# EAGLE design action_module_base (EAGLE 7.2.0)
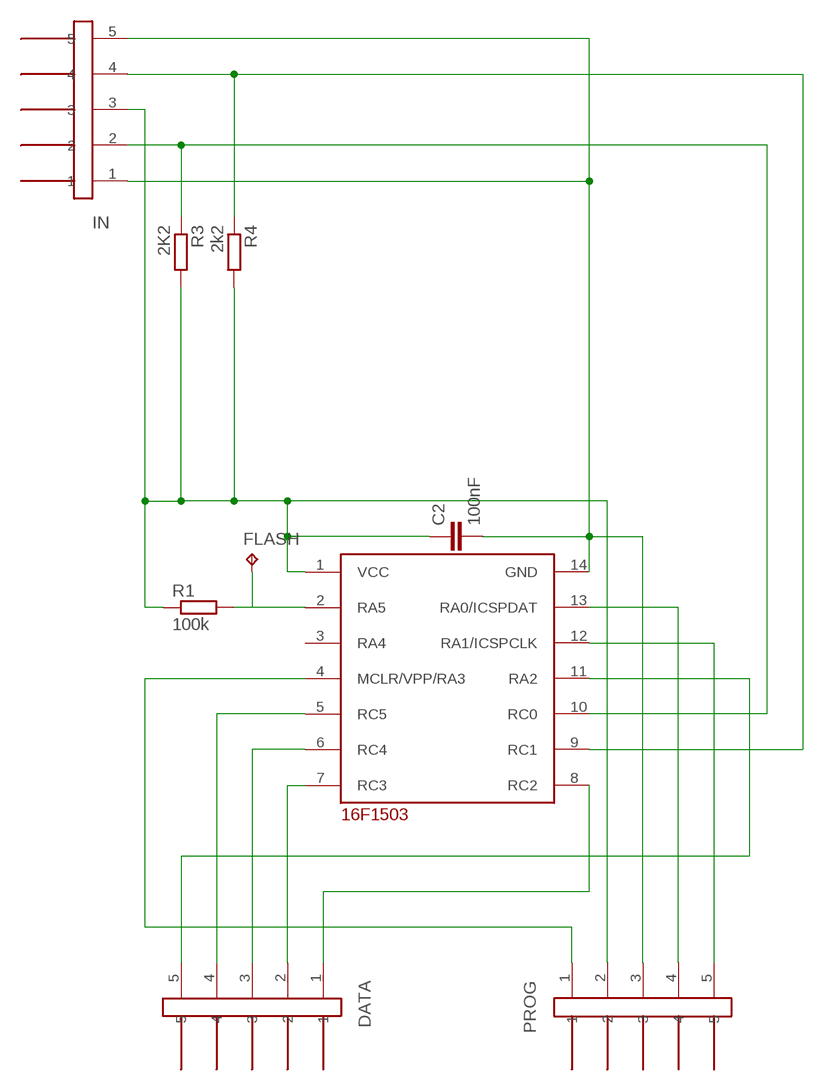
[diagram p0: schematic, sheet 1]

## Parts
C2  100nF  C-EUC0603K  [C0603K]
DATA  JUMPER5M  [JUMPER5M]
FLASH  TPB1,27  [B1,27]
IN  JUMPER5M-90  [JUMPER5M-90]
PROG  JUMPER5M  [JUMPER5M]
R1  100k  R-EU_R0603  [R0603]
R3  2K2  R-EU_R0603  [R0603]
R4  2k2  R-EU_R0603  [R0603]
U1  16F103-TSSOP  [TSSOP14]

## Nets
GND: C2.2 IN.1 IN.5 PROG.3 U1.14(GND)
N$1: DATA.2 U1.7(RC3)
N$2: IN.2 R3.1 U1.10(RC0)
N$3: FLASH.TP R1.2 U1.2(RA5)
N$5: IN.4 R4.1 U1.9(RC1)
N$11: DATA.5 U1.11(RA2)
N$12: DATA.4 U1.5(RC5)
N$13: PROG.1 U1.4(MCLR/VPP/RA3)
N$14: PROG.4 U1.13(RA0/ICSPDAT)
N$15: PROG.5 U1.12(RA1/ICSPCLK)
N$17: DATA.3 U1.6(RC4)
N$18: DATA.1 U1.8(RC2)
VCC: C2.1 IN.3 PROG.2 R1.1 R3.2 R4.2 U1.1(VCC)
Unconnected: U1.3(RA4)

## Library data of the parts
C2 = resistor:C-EU: CAPACITOR, European symbol
DATA PROG = !stavebnice03:JUMPER5M
FLASH = testpad:TP: Test pad
IN = !stavebnice03:JUMPER5M-90
R1 R3 R4 = resistor:R-EU_: RESISTOR, European symbol
U1 = !stavebnice03:16F103-TSSOP

## Net classes
0 default: clearance 0.205 mm

## Board
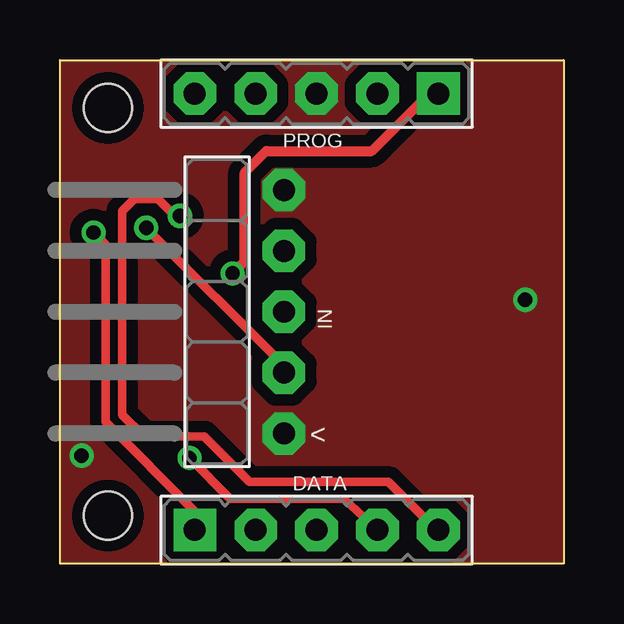
[diagram p1: board, top side]
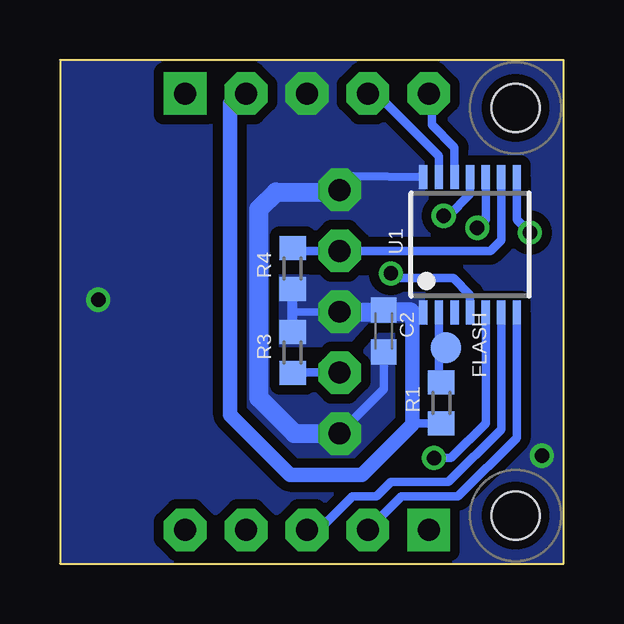
[diagram p2: board, bottom side, seen from below]

Size 21 x 21 mm. Coordinates in mm from the lower left corner, seen from the top.
Outline: 0,0 0,21 21,21 21,0 0,0
Copper layers (1*16): Top 0.035mm / dielectric 1.5mm / Bottom 0.035mm
Design rules "default *": minimum track width 10mil, minimum drill 0.6mm, track to track 8mil, track to pad 8mil, pad to pad 8mil, via to via 8mil, smd to smd 8mil, copper to edge 0mil, drill to drill 1mil, minimum pad ring 10mil, minimum via ring 8mil, stop-mask expansion 4mil, vias tented up to drill 0.7mm, thermal gap 10mil
Holes 2 mm at 2,19 2,2

### Footprints (pad centres in the part's own frame; a part is rotated, then mirrored left to right if it is on the bottom)
C0603K = smd 1.05 x 1.08: 1 -0.875,0; 2 0.875,0
JUMPER5M = drill 0.914 pad 1.778 square: 1 -5.08,0 | drill 0.914 pad 1.778 octagon: 2 -2.54,0; 3 0,0; 4 2.54,0; 5 5.08,0
B1,27 = smd 1.27 x 1.27: TP 0,0
JUMPER5M-90 = drill 0.914 pad 1.778 octagon: 1 -5.08,-2.54; 2 -2.54,-2.54; 3 0,-2.54; 4 2.54,-2.54; 5 5.08,-2.54
R0603 = smd 1 x 1.1: 1 -0.85,0; 2 0.85,0
TSSOP14 = smd 0.35 x 1: 1 -1.95,-2.825; 2 -1.3,-2.825; 3 -0.65,-2.825; 4 0,-2.825; 5 0.65,-2.825; 6 1.3,-2.825; 7 1.95,-2.825; 8 1.95,2.825; 9 1.3,2.825; 10 0.65,2.825; 11 0,2.825; 12 -0.65,2.825; 13 -1.3,2.825; 14 -1.95,2.825

### Placement (x,y rotation side)
C2  7.5,9.7 270 bottom
DATA  10.7,1.4 0 top
FLASH  4.9,9 0 bottom
IN  6.8,10.5 90 top
PROG  10.7,19.6 180 top
R1  5.1,6.7 90 bottom
R3  11.3,8.8 90 bottom
R4  11.3,12.3 270 bottom
U1  3.9,13.3 0 bottom

### Tracks (layer width: path | path; a pad name or v marks a point on that pad's centre or on a via)
GND  (via drill 0.6)
  Bottom 0.356: C2.2 7.5,7.28 IN.1 | 9.5,15.5 9.4,15.6 | U1.14 8.78,16.16 IN.5
  Bottom 0.8: 9.5,15.5 12,15.5 12.7,14.8 12.7,6.9 11.22,5.42 IN.1
  other vias: 0.9,4.5 19.4,11
  pour Top (isolate 0.483, rank 2, no thermals): 0.1,0.1 0.1,20.9 20.9,20.9 20.9,0.1
  pour Bottom (isolate 0.406, rank 2, no thermals): 0.1,0.1 0.1,20.9 20.9,20.9 20.9,0.1
N$1
  Bottom 0.35: 4.4,2.8 6.76,2.8 DATA.2
  Bottom 0.356: U1.7 1.95,5.25 4.4,2.8
N$2  (via drill 0.6)
  Top 0.356: IN.2 9.34,8.26 v3.6,14
  Bottom 0.356: IN.2 R3.1 | U1.10 3.25,14.35 v3.6,14
  Bottom 0.406: R3.1
N$3
  Bottom 0.356: R1.2 5.05,7.55 5.2,7.7 5.2,8.8 | 5.2,8.8 U1.2 | FLASH.TP 5.1,8.9 5.2,8.8
N$5
  Bottom 0.356: U1.9 2.6,13.5 3.06,13.04 IN.4 11.19,13.04 R4.1
N$11  (via drill 0.6)
  Top 0.35: 13.7,3.4 15.78,1.32 DATA.5
  Top 0.356: 13.7,3.4 7.9,3.4 6,5.3 3.5,5.3 2.6,6.2 2.6,14.7 3.1,15.2 4.1,15.2 4.8,14.5 v5,14.5
  Bottom 0.356: U1.11 3.9,15.4 4.8,14.5 v5,14.5
N$12  (via drill 0.6)
  Top 0.35: 7.1,2.7 11.84,2.7 DATA.4
  Top 0.356: v5.4,4.4 7.1,2.7
  Bottom 0.356: U1.5 3.25,5.85 4.7,4.4 v5.4,4.4
N$13  (via drill 0.6)
  Top 0.406: v7.2,12.1 7.7,12.6 7.7,16.3 8.6,17.2 13,17.2 15.3,19.5 15.58,19.5 PROG.1
  Bottom 0.356: U1.4 3.9,11.2 4.6,11.9 7,11.9 v7.2,12.1
N$14
  Bottom 0.35: 5.8,17.6 7.8,19.6 PROG.4
  Bottom 0.356: 5.8,17.6 5.2,17 U1.13
N$15
  Bottom 0.356: U1.12 4.55,17.35 5.5,18.3 5.5,19.48 PROG.5
N$17
  Bottom 0.356: U1.6 2.6,5.6 4.8,3.4 7.2,3.4 7.8,2.8 8.8,2.8 10.2,1.4 DATA.3
N$18  (via drill 0.6)
  Top 0.35: 1.9,5.9 5.62,2.18 DATA.1
  Top 0.356: 1.9,5.9 1.9,13.3 v1.4,13.8
  Bottom 0.356: U1.8 1.95,14.35 v1.4,13.8
VCC
  Bottom 0.305: IN.3 11.2,10.5 11.3,10.4
  Bottom 0.356: 7.22,10.5 C2.1 7.18,10.51 | 5.89,10.49 5.9,10.5 U1.1 6.22,10.47 6.3,10.3 | R1.1 6.25,5.85 6.3,7.4
  Bottom 0.406: R3.2 11.3,10.4 R4.2
  Bottom 0.6: 6.3,10.3 6.3,7.4 6.3,5.8 8.4,3.7 11.4,3.7 13.9,6.2 13.9,19.19 13.49,19.6 PROG.2
  Bottom 0.8: IN.3 7.22,10.5 | 6.3,10.3 6.4,10.5 7.45,10.5 C2.1
  pour Bottom (isolate 0.406, no thermals): 11.9,11.9 11.9,9.2 9.1,9.2 8.2,10.2 6,10.2 5.4,10.8 5.4,11.8

### Text on the board
Top: II=I+I
Bottom: II=I+I
Dimension: action base
tValues: RA1 | RA0 | GND | VCC | RA3 | RC2 | RC3 | RC4 | RC5 | RA2